# Altium project Communication_AVR.PrjPcb
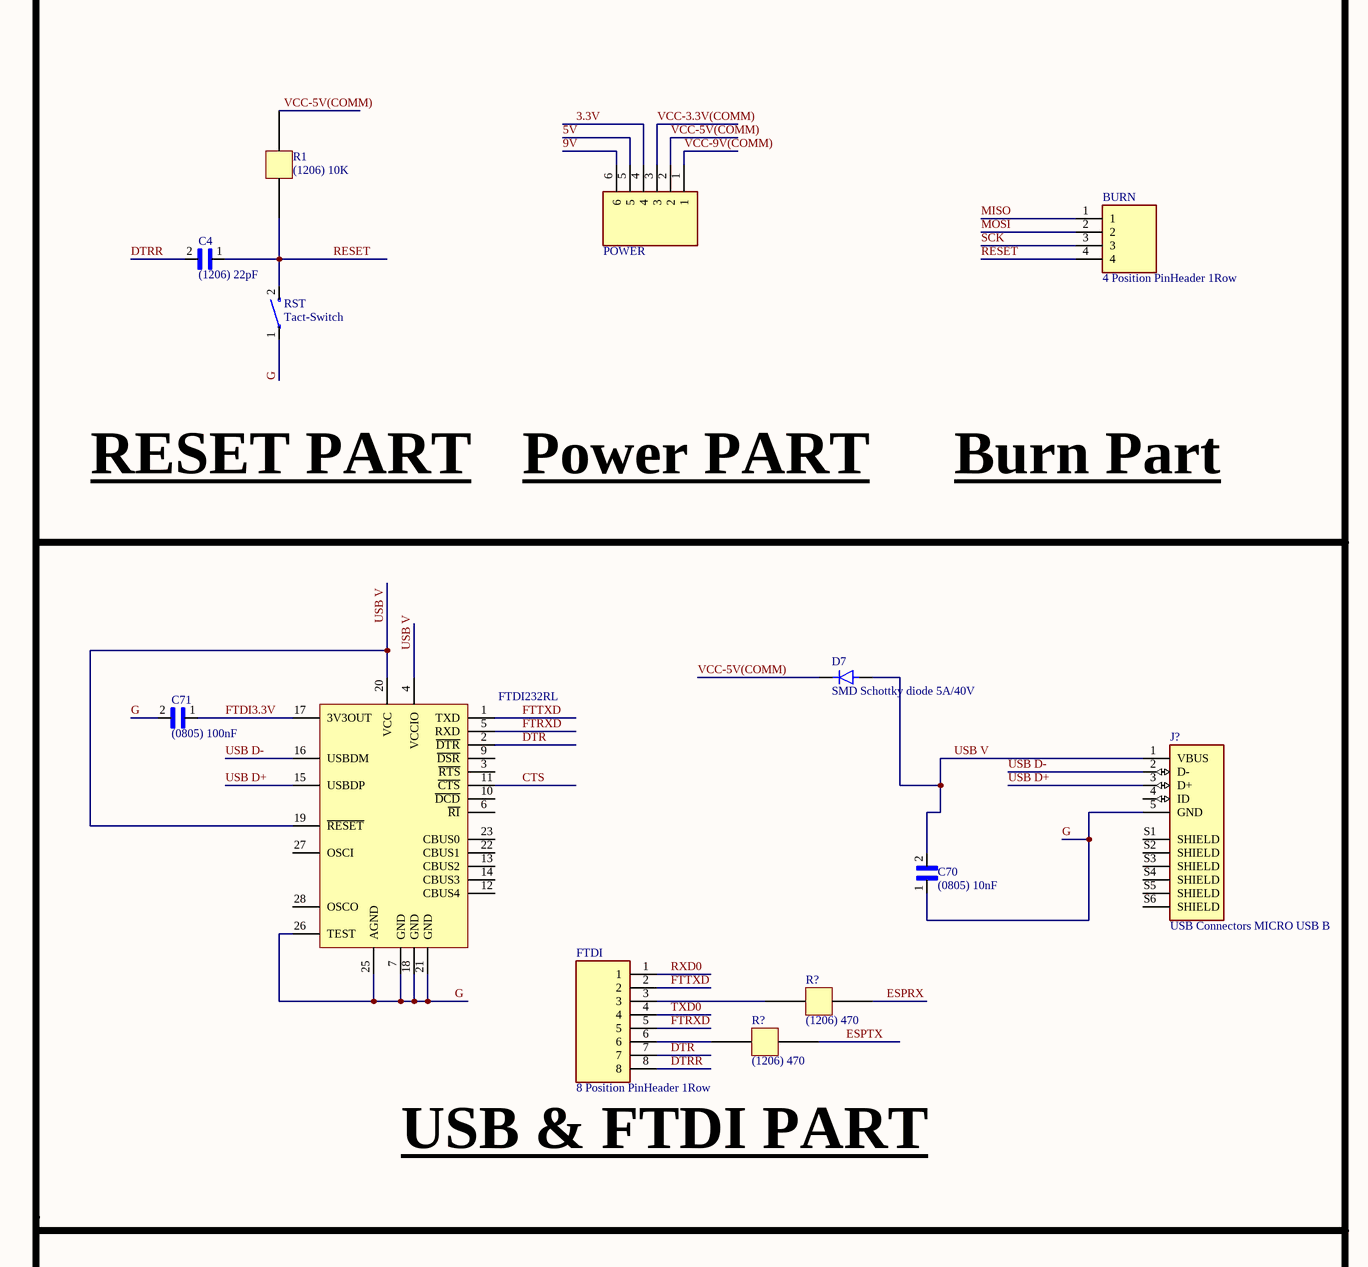
[diagram p0: Communication_Subsystem_ATmega2560AU.SchDoc, top left]
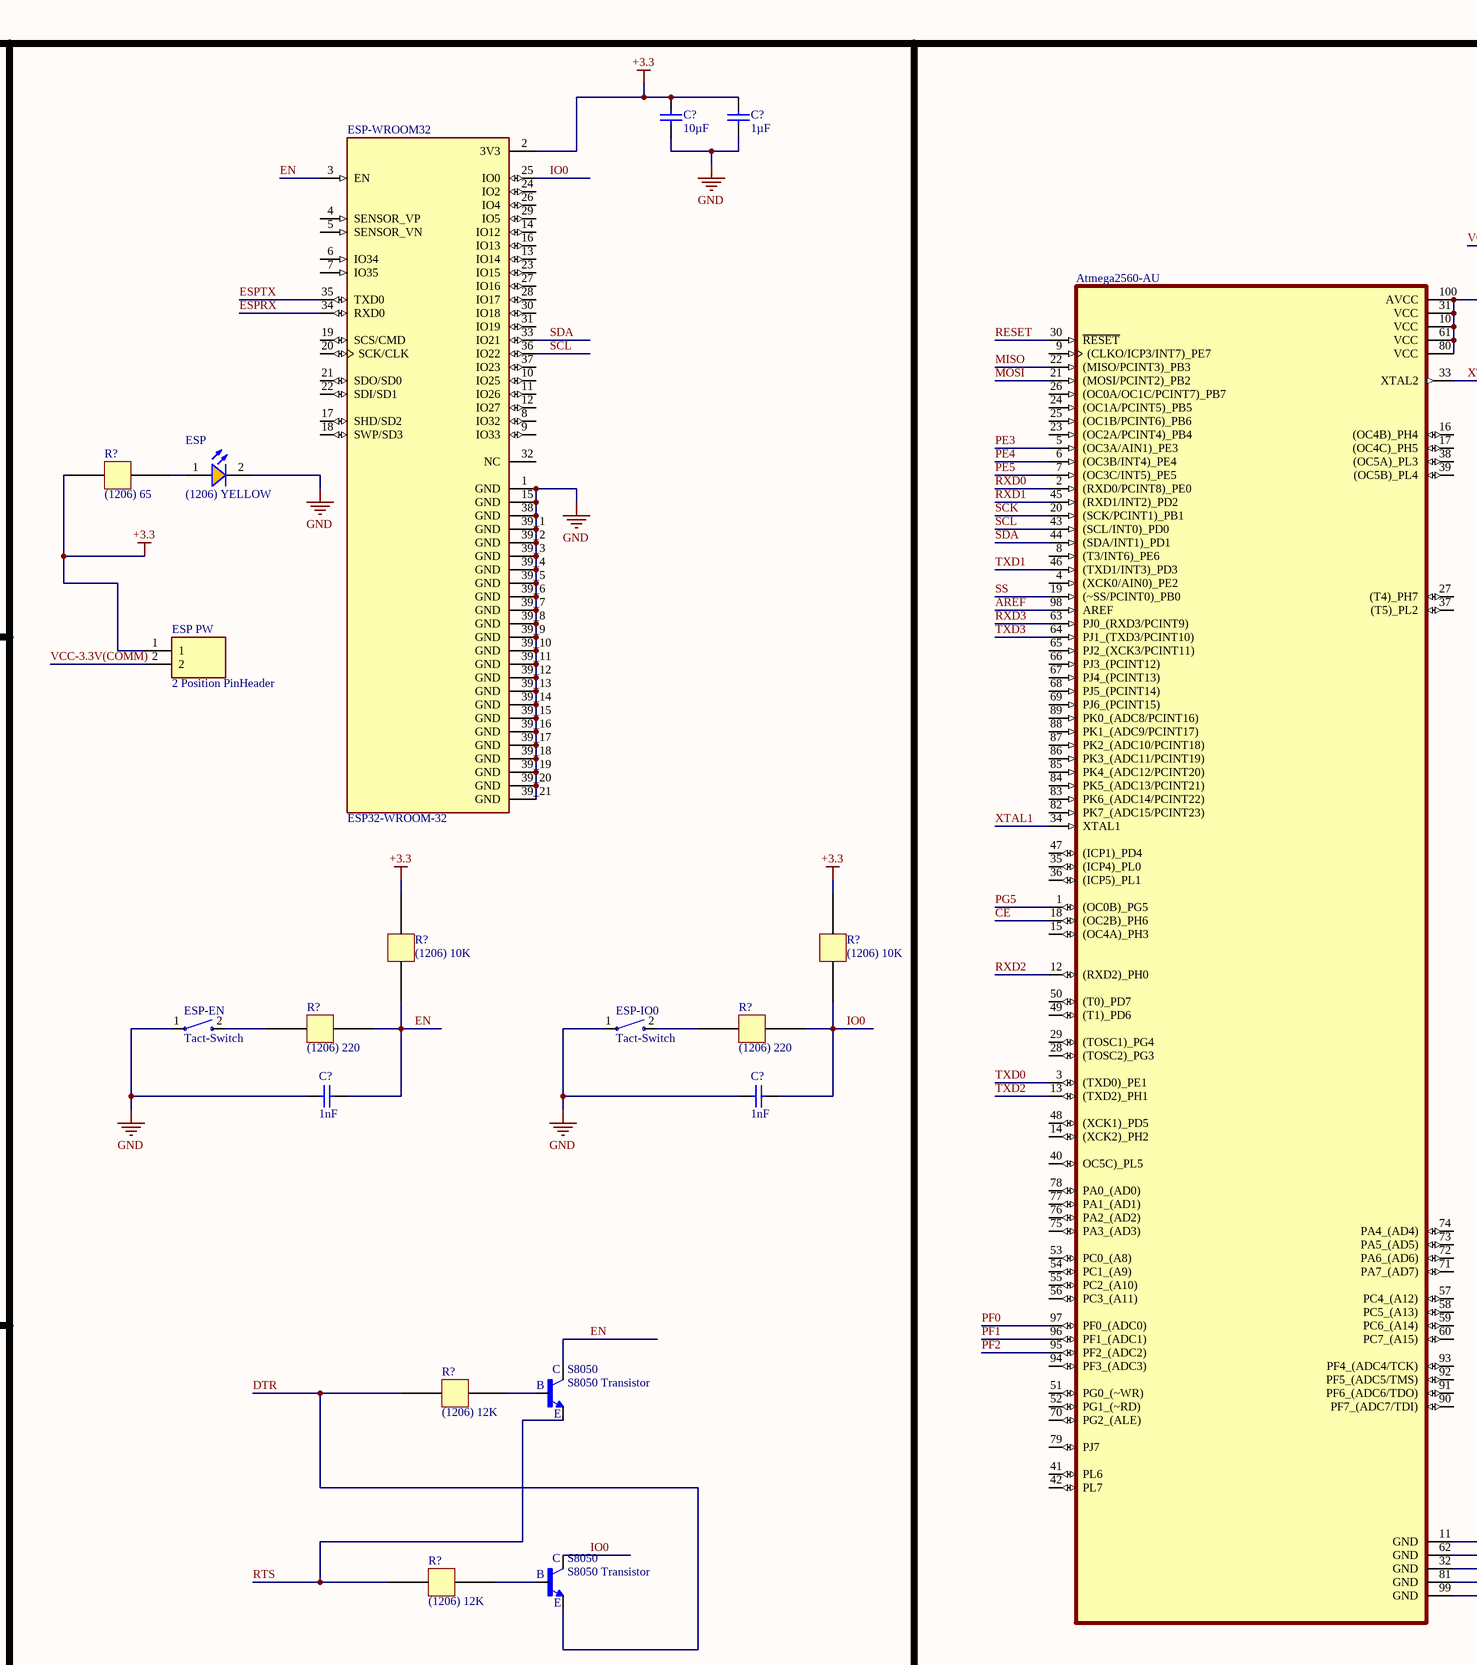
[diagram p1: Communication_Subsystem_ATmega2560AU.SchDoc, top middle]
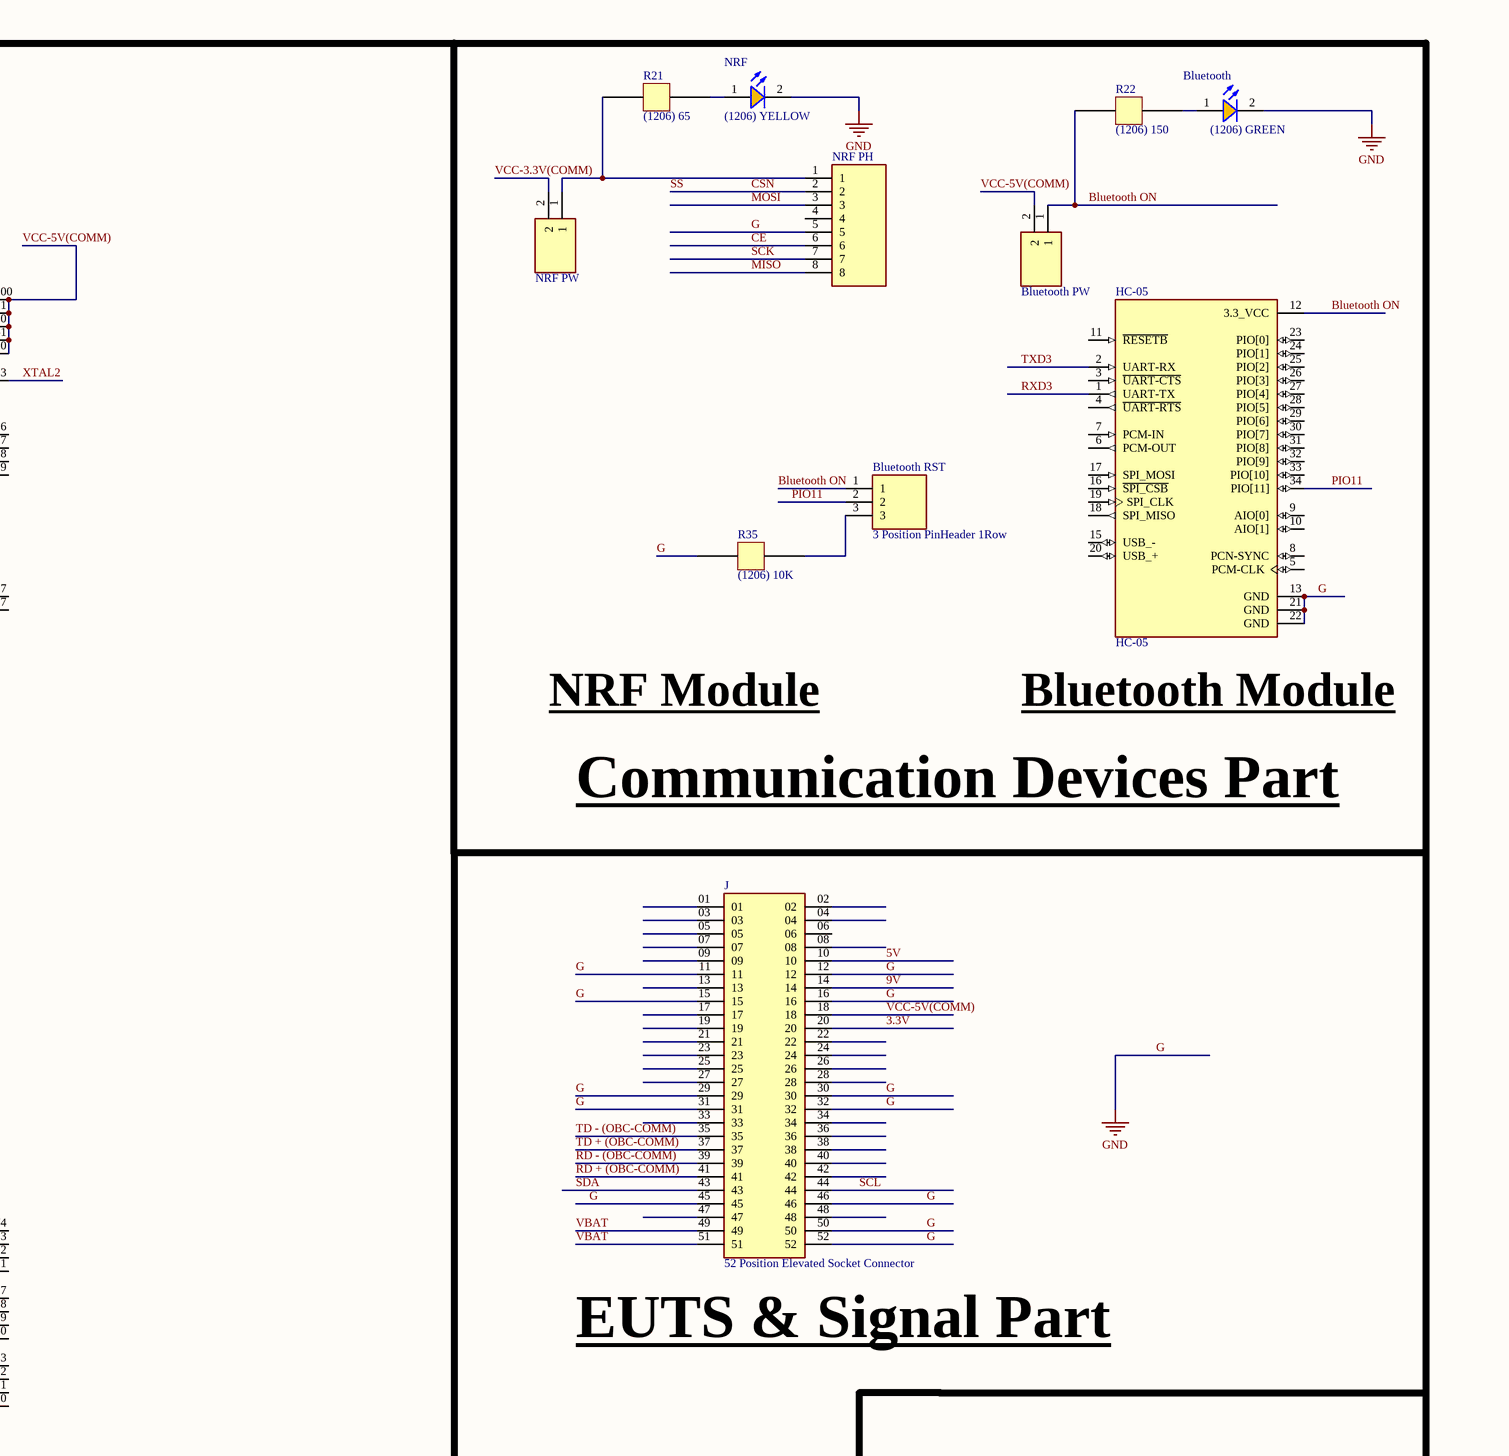
[diagram p2: Communication_Subsystem_ATmega2560AU.SchDoc, top right]
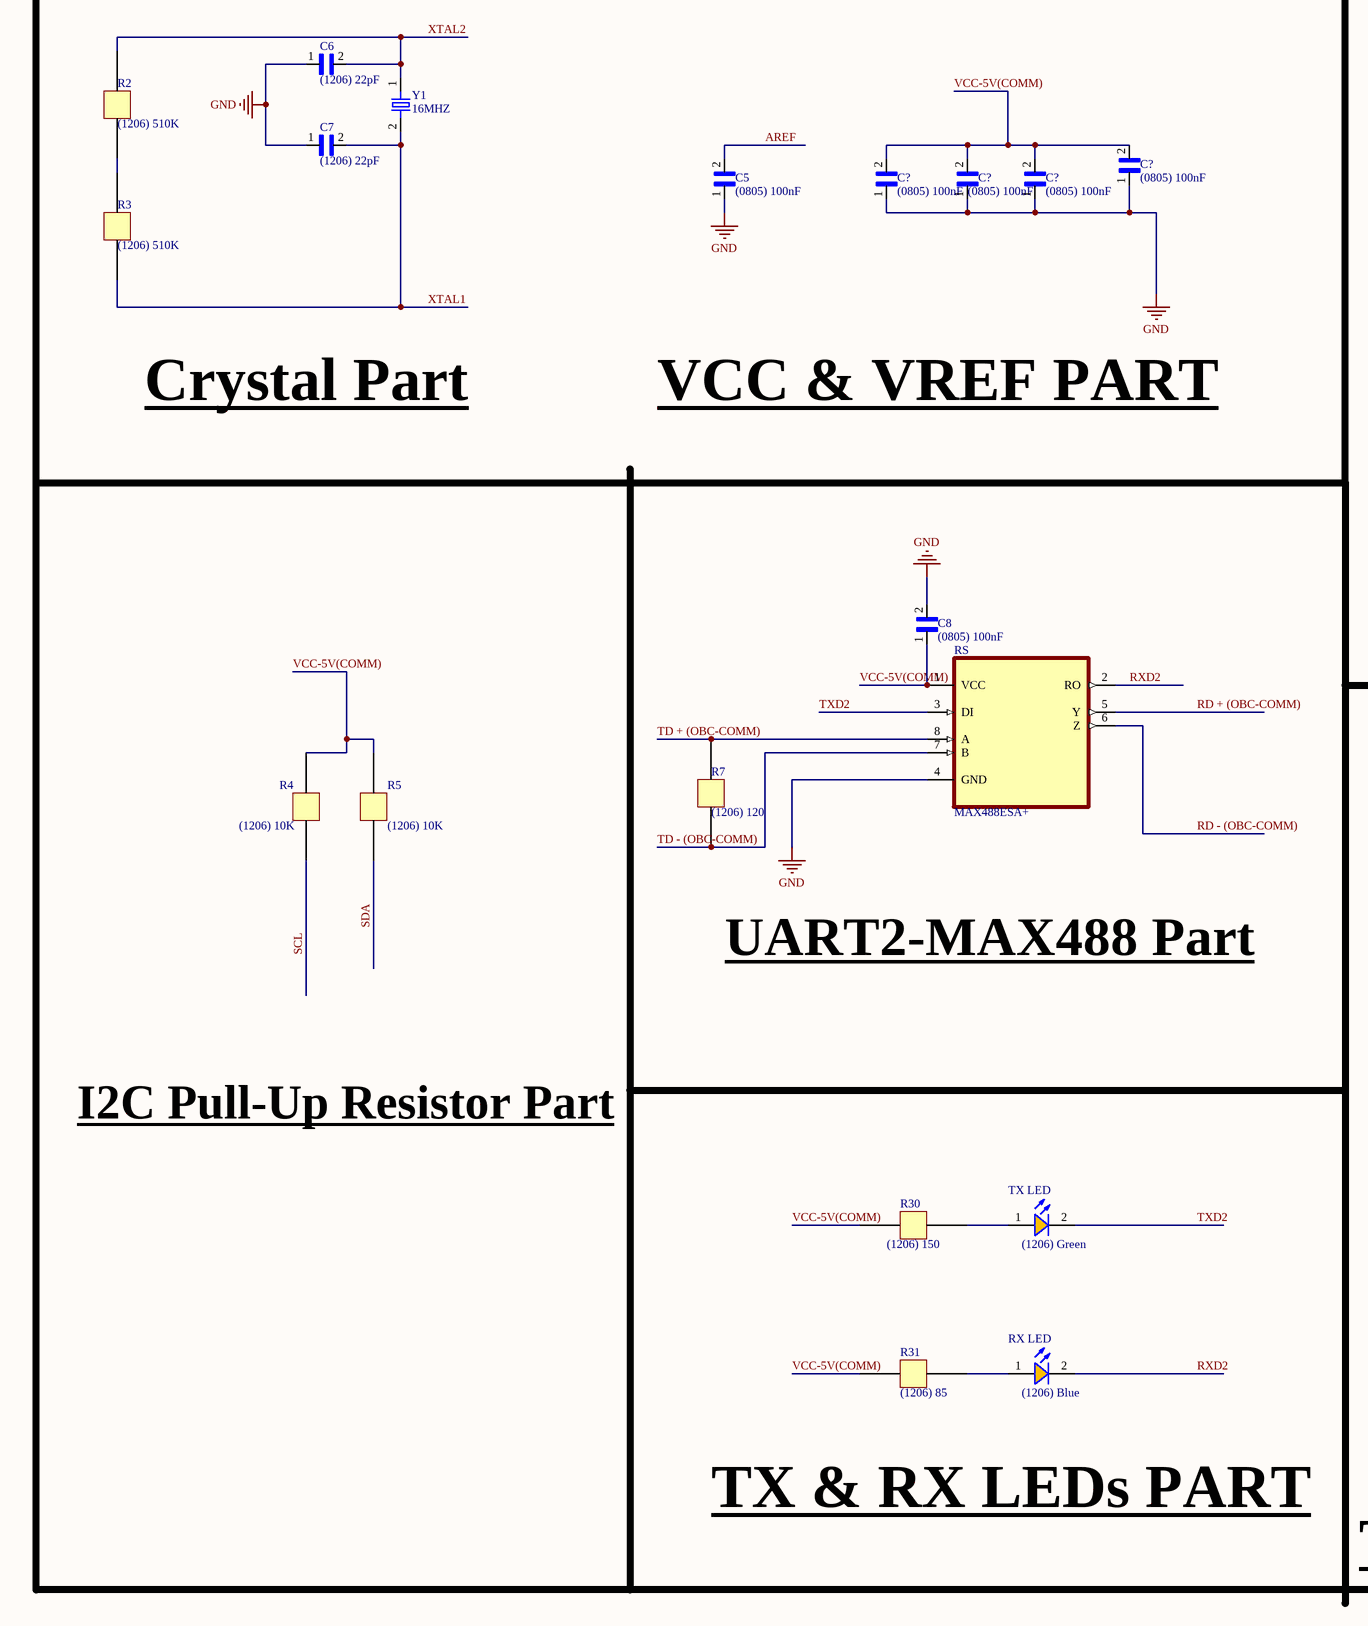
[diagram p3: Communication_Subsystem_ATmega2560AU.SchDoc, bottom left]
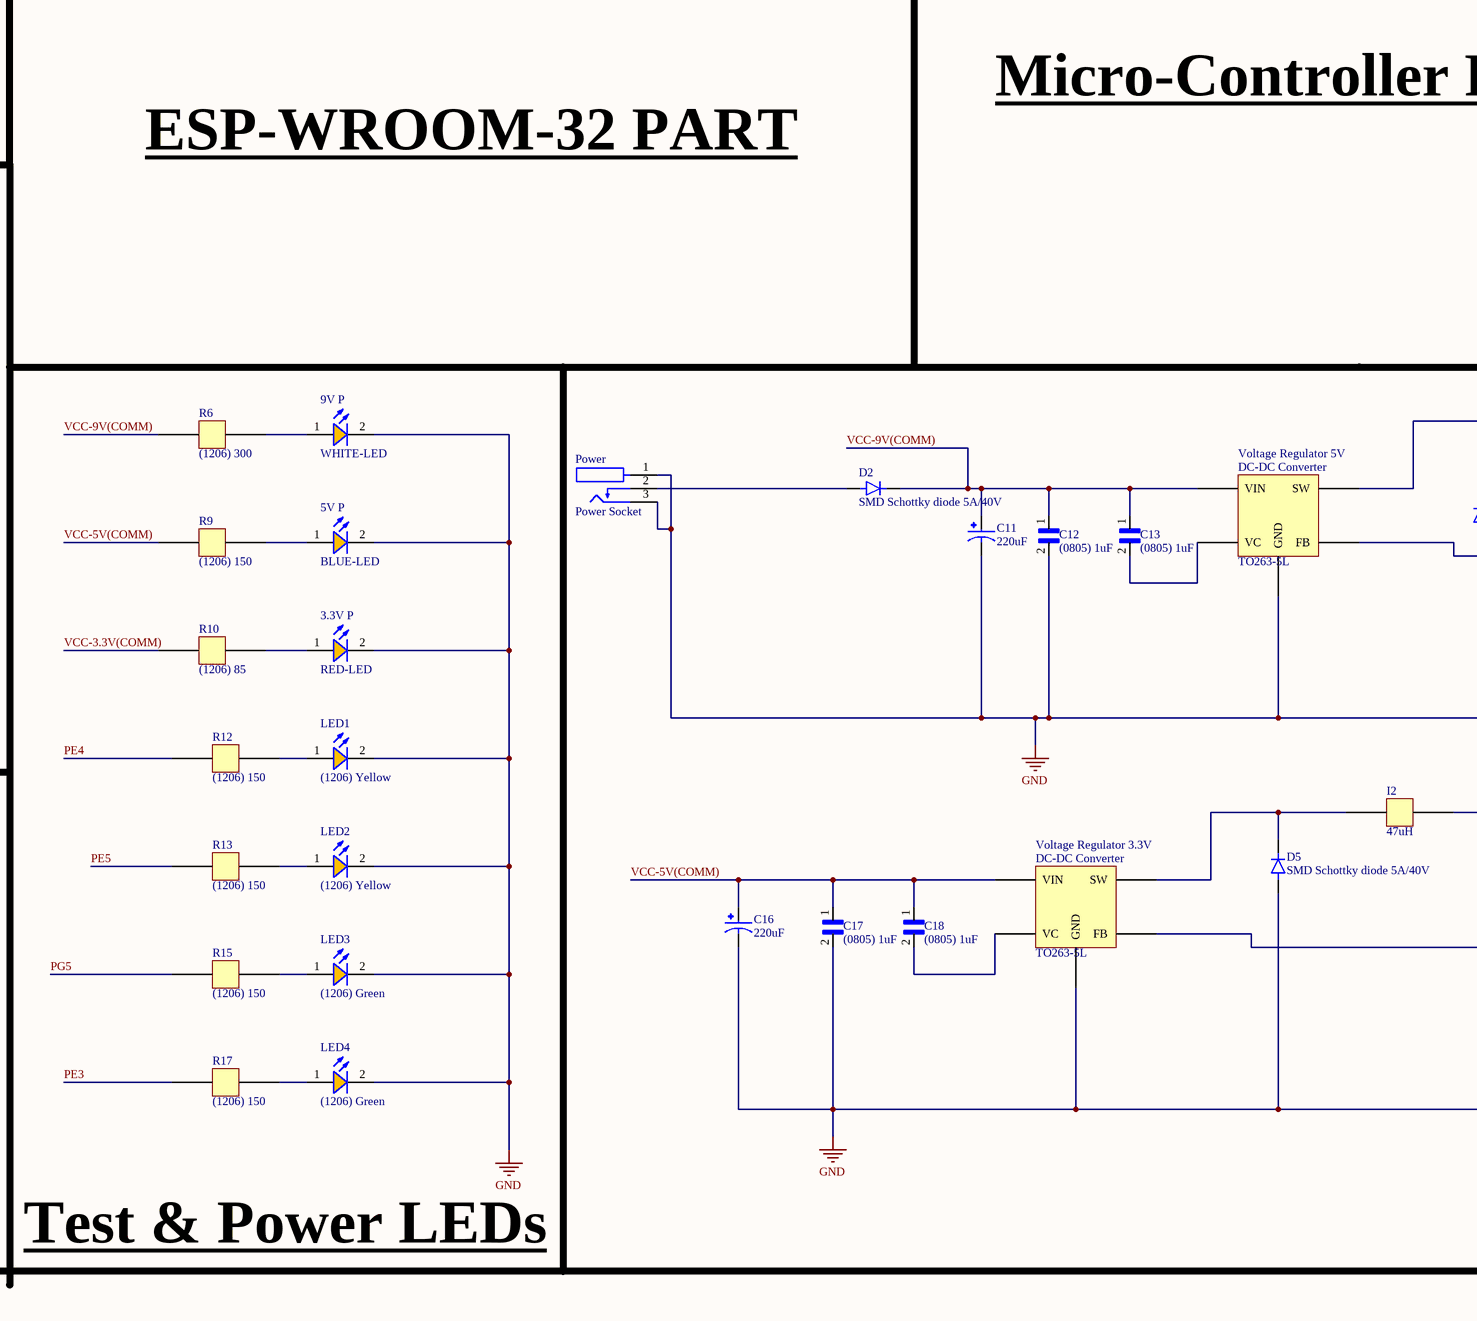
[diagram p4: Communication_Subsystem_ATmega2560AU.SchDoc, bottom middle]
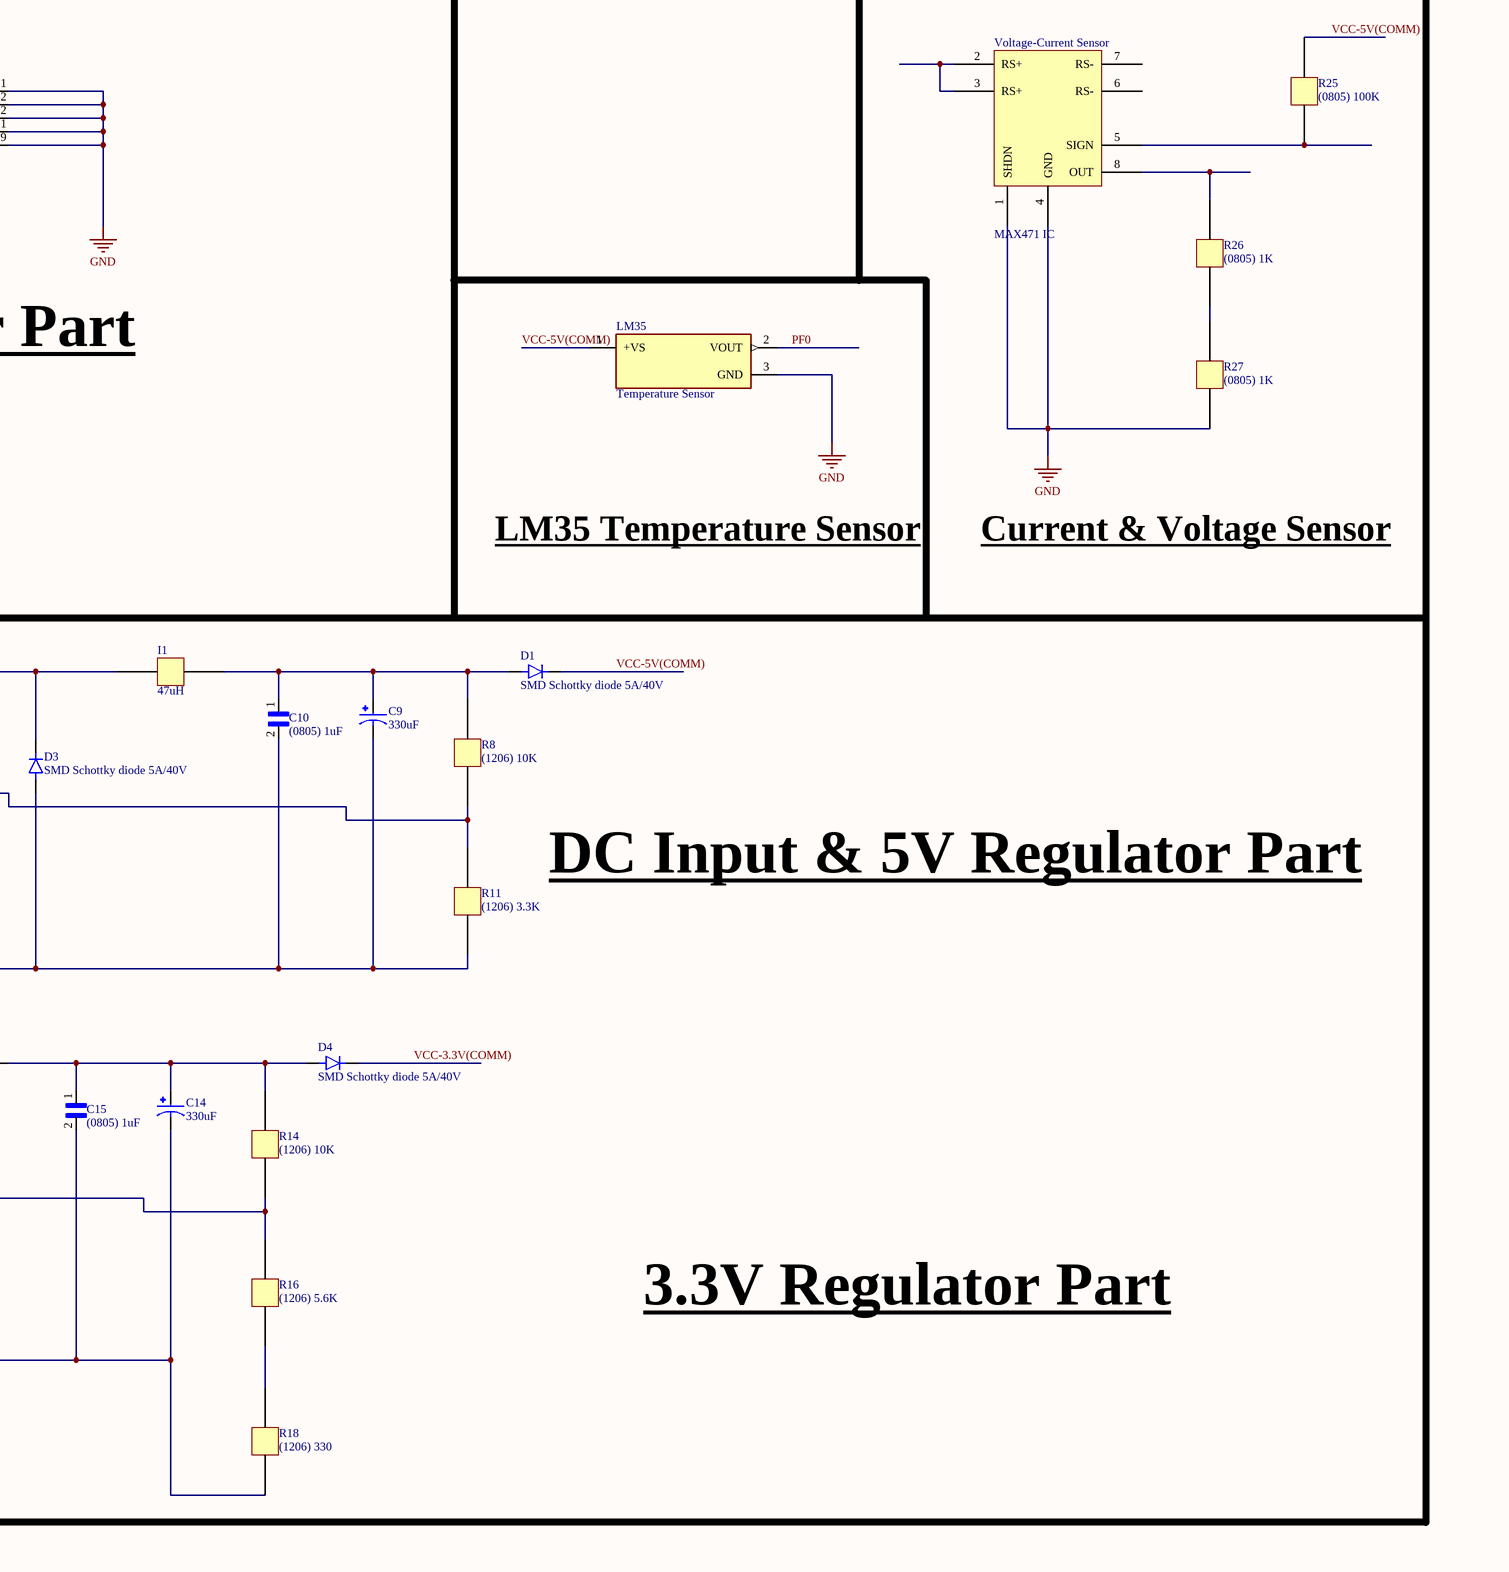
[diagram p5: Communication_Subsystem_ATmega2560AU.SchDoc, bottom right]
1 sheet, 106 parts. Net scope: global (net labels, ports and power ports of the same name join across sheets).
Board file: Communication_Subsystem_ATmega2560AU.PcbDoc

## Sheet Communication_Subsystem_ATmega2560AU.SchDoc
size A1; SheetNumber: 1; SheetTotal: 1

### Parts
(Parts that share a designator on the sheet are numbered #1, #2 ... from top to bottom, then left to right.)
3.3V_P  RED-LED  [RESC3015X65-01]
5V_P  BLUE-LED  [RESC3015X65-01]
9V_P  WHITE-LED  [RESC3015X65-01]
Atmega2560-AU  (no value)  [QFP50P1600X1600X120-100N]
Bluetooth  (1206) GREEN  [RESC3015X65-01]
Bluetooth_PW  2 Position PinHeader  [TE_2-103327-2]  (value not drawn)
Bluetooth_RST  3 Position PinHeader 1Row  [TE_3-103327-3]
BURN  4 Position PinHeader 1Row  [TE_3-644456-4]
C4  (1206) 22pF  [CAPC3216X125N0]
C5  (0805) 100nF  [CAPC2012X95N-0]
C6  (1206) 22pF  [CAPC3216X125N0]
C7  (1206) 22pF  [CAPC3216X125N0]
C8  (0805) 100nF  [CAPC2012X95N-0]
C9  330uF  [CAPPRD500W60D1250H2500]
C10  (0805) 1uF  [CAPC2012X95N-0]
C11  220uF  [CAPPRD500W60D1250H2500]
C12  (0805) 1uF  [CAPC2012X95N-0]
C13  (0805) 1uF  [CAPC2012X95N-0]
C14  330uF  [CAPPRD500W60D1250H2500]
C15  (0805) 1uF  [CAPC2012X95N-0]
C16  220uF  [CAPPRD500W60D1250H2500]
C17  (0805) 1uF  [CAPC2012X95N-0]
C18  (0805) 1uF  [CAPC2012X95N-0]
C70  (0805) 10nF  [CAPC2012X95N-0]
C71  (0805) 100nF  [CAPC2012X95N-0]
C?#1  Capacitance: 10µF  [0603 - cap]  (hidden comment: Cap_CER_1U_10V_0603)
C?#2  Capacitance: 1µF  [0603 - cap]  (hidden comment: Cap_CER_1U_10V_0603)
C?#3  Capacitance: 1nF  [0603 - cap]  (hidden comment: Cap_CER_1U_10V_0603)
C?#4  Capacitance: 1nF  [0603 - cap]  (hidden comment: Cap_CER_1U_10V_0603)
C?#5  (0805) 100nF  [CAPC2012X95N-0]
C?#6  (0805) 100nF  [CAPC2012X95N-0]
C?#7  (0805) 100nF  [CAPC2012X95N-0]
C?#8  (0805) 100nF  [CAPC2012X95N-0]
D1  SMD Schottky diode 5A/40V  [DIOM5227X270N]
D2  SMD Schottky diode 5A/40V  [DIOM5227X270N]
D3  SMD Schottky diode 5A/40V  [DIOM5227X270N]
D4  SMD Schottky diode 5A/40V  [DIOM5227X270N]
D5  SMD Schottky diode 5A/40V  [DIOM5227X270N]
D7  SMD Schottky diode 5A/40V  [DIOM5227X270N]
ESP  (1206) YELLOW  [RESC3015X65-01]
ESP-EN  Tact-Switch  [Tact Switch]
ESP-IO0  Tact-Switch  [Tact Switch]
ESP-WROOM32  ESP32-WROOM-32  [MODULE_ESP32-WROOM-32]
ESP_PW  2 Position PinHeader  [TE_2-103327-2]
FTDI  8 Position PinHeader 1Row  [TE_5-534237-6]
FTDI232RL  IC_FT232RL  [SSOP-28]  (value not drawn)
HC-05  HC-05  [XCVR_HC-05]
I1  47uH  [IND]
I2  47uH  [IND]
J  52 Position Elevated Socket Connector  [SAMTEC_ESQ-126-39-G-D]
J?  USB Connectors MICRO USB B  [MOLEX_47346-0001]
LED1  (1206) Yellow  [RESC3015X65-01]
LED2  (1206) Yellow  [RESC3015X65-01]
LED3  (1206) Green  [RESC3015X65-01]
LED4  (1206) Green  [RESC3015X65-01]
LM35  Temperature Sensor  [TO92127P521H735-4]
NRF  (1206) YELLOW  [RESC3015X65-01]
NRF_PH  8 Position PinHeader 2Row  [TE_8-146256-8]  (value not drawn)
NRF_PW  2 Position PinHeader  [TE_2-103327-2]  (value not drawn)
POWER#1  6 Position PinHeader 1Row  [TE_6-146285-6]  (value not drawn)
Power#2  Power Socket  [GRAVITECH_CON-SOCJ-2155]
R1  (1206) 10K  [CAPC3216X125N0]
R2  (1206) 510K  [CAPC3216X125N0]
R3  (1206) 510K  [CAPC3216X125N0]
R4  (1206) 10K  [CAPC3216X125N0]
R5  (1206) 10K  [CAPC3216X125N0]
R6  (1206) 300  [CAPC3216X125N0]
R7  (1206) 120  [CAPC3216X125N0]
R8  (1206) 10K  [CAPC3216X125N0]
R9  (1206) 150  [CAPC3216X125N0]
R10  (1206) 85  [CAPC3216X125N0]
R11  (1206) 3.3K  [CAPC3216X125N0]
R12  (1206) 150  [CAPC3216X125N0]
R13  (1206) 150  [CAPC3216X125N0]
R14  (1206) 10K  [CAPC3216X125N0]
R15  (1206) 150  [CAPC3216X125N0]
R16  (1206) 5.6K  [CAPC3216X125N0]
R17  (1206) 150  [CAPC3216X125N0]
R18  (1206) 330  [CAPC3216X125N0]
R21  (1206) 65  [CAPC3216X125N0]
R22  (1206) 150  [CAPC3216X125N0]
R25  (0805) 100K  [CAPC2012X95N-0]
R26  (0805) 1K  [CAPC2012X95N-0]
R27  (0805) 1K  [CAPC2012X95N-0]
R30  (1206) 150  [CAPC3216X125N0]
R31  (1206) 85  [CAPC3216X125N0]
R35  (1206) 10K  [CAPC3216X125N0]
R?#1  (1206) 65  [CAPC3216X125N0]
R?#2  (1206) 10K  [CAPC3216X125N0]
R?#3  (1206) 10K  [CAPC3216X125N0]
R?#4  (1206) 220  [CAPC3216X125N0]
R?#5  (1206) 220  [CAPC3216X125N0]
R?#6  (1206) 470  [CAPC3216X125N0]
R?#7  (1206) 470  [CAPC3216X125N0]
R?#8  (1206) 12K  [CAPC3216X125N0]
R?#9  (1206) 12K  [CAPC3216X125N0]
RS  MAX488ESA+  [SOIC127P600X175-8N0]
RST  Tact-Switch  [Tact Switch]
RX_LED  (1206) Blue  [RESC3015X65-01]
S8050#1  S8050 Transistor  [S8050-Transistor]
S8050#2  S8050 Transistor  [S8050-Transistor]
TX_LED  (1206) Green  [RESC3015X65-01]
Voltage-Current_Sensor  MAX471 IC  [SOIC127P600X168-8N]
Voltage_Regulator_3.3V  Voltage Regulator  [TO-263-5]  (value not drawn)
Voltage_Regulator_5V  Voltage Regulator  [TO-263-5]  (value not drawn)
Y1  16MHZ  [XTAL1140X490X430N-0]

### Nets
+3.3: C?#1.2 C?#2.2 ESP-WROOM32.2(3V3) ESP_PW.1 R?#1.1 R?#2.2 R?#3.2
G: 3.3V_P.2(K) 5V_P.2(K) 9V_P.2(K) Atmega2560-AU.11(GND) Atmega2560-AU.32(GND) Atmega2560-AU.62(GND) Atmega2560-AU.81(GND) Atmega2560-AU.99(GND) Bluetooth.2(K) C5.1 C6.1 C7.1 C8.2 C9.N C10.2 C11.N C12.2 C14.N C15.2 C16.N C17.2 C70.1 C71.2 C?#1.1 C?#2.1 C?#3.1 C?#4.1 C?#5.1 C?#6.1 C?#7.1 C?#8.1 D3.A D5.A ESP.2(K) ESP-EN.1 ESP-IO0.1 ESP-WROOM32.1(GND) ESP-WROOM32.15(GND) ESP-WROOM32.38(GND) ESP-WROOM32.39_1(GND) ESP-WROOM32.39_2(GND) ESP-WROOM32.39_3(GND) ESP-WROOM32.39_4(GND) ESP-WROOM32.39_5(GND) ESP-WROOM32.39_6(GND) ESP-WROOM32.39_7(GND) ESP-WROOM32.39_8(GND) ESP-WROOM32.39_9(GND) ESP-WROOM32.39_10(GND) ESP-WROOM32.39_11(GND) ESP-WROOM32.39_12(GND) ESP-WROOM32.39_13(GND) ESP-WROOM32.39_14(GND) ESP-WROOM32.39_15(GND) ESP-WROOM32.39_16(GND) ESP-WROOM32.39_17(GND) ESP-WROOM32.39_18(GND) ESP-WROOM32.39_19(GND) ESP-WROOM32.39_20(GND) ESP-WROOM32.39_21(GND) FTDI232RL.7(GND) FTDI232RL.18(GND) FTDI232RL.21(GND) FTDI232RL.25(AGND) FTDI232RL.26(TEST) HC-05.13(GND) HC-05.21(GND) HC-05.22(GND) J.11 J.12 J.15 J.16 J.29 J.30 J.31 J.32 J.45 J.46 J.50 J.52 J?.5(GND) LED1.2(K) LED2.2(K) LED3.2(K) LED4.2(K) LM35.3(GND) NRF.2(K) NRF_PH.5 Power#2.1 Power#2.3 R11.1 R18.1 R27.1 R35.1 RS.4(GND) RST.1 Voltage-Current_Sensor.1(SHDN) Voltage-Current_Sensor.4(GND) Voltage_Regulator_3.3V.1(GND) Voltage_Regulator_5V.1(GND)  [also labelled GND]
NC: FTDI232RL.8(NC) FTDI232RL.24(NC)
3.3V: J.20 POWER#1.4
5V: J.10 POWER#1.5
9V: J.14 POWER#1.6
AREF: Atmega2560-AU.98(AREF) C5.2
Bluetooth ON: Bluetooth_PW.1 Bluetooth_RST.1 HC-05.12(3.3_VCC) R22.1
CE: Atmega2560-AU.18((OC2B)_PH6) NRF_PH.6
CSN: Atmega2560-AU.19((~SS/PCINT0)_PB0) NRF_PH.2  [also labelled SS]
CTS: FTDI232RL.11(~{CTS})
DTR: FTDI.7 FTDI232RL.2(~{DTR}) R?#8.1 S8050#2.1(E)
DTRR: C4.2 FTDI.8
EN: C?#3.2 ESP-WROOM32.3(EN) R?#2.1 R?#4.2 S8050#1.3(C)
ESPRX: ESP-WROOM32.34(RXD0) R?#6.2
ESPTX: ESP-WROOM32.35(TXD0) R?#7.2
FTDI3.3V: C71.1 FTDI232RL.17(3V3OUT)
FTRXD: FTDI.5 FTDI232RL.5(RXD)
FTTXD: FTDI.2 FTDI232RL.1(TXD)
IO0: C?#4.2 ESP-WROOM32.25(IO0) R?#3.1 R?#5.2 S8050#2.3(C)
MISO: Atmega2560-AU.22((MISO/PCINT3)_PB3) BURN.1 NRF_PH.8
MOSI: Atmega2560-AU.21((MOSI/PCINT2)_PB2) BURN.2 NRF_PH.3
PE3: Atmega2560-AU.5((OC3A/AIN1)_PE3) R17.1
PE4: Atmega2560-AU.6((OC3B/INT4)_PE4) R12.1
PE5: Atmega2560-AU.7((OC3C/INT5)_PE5) R13.1
PF0: Atmega2560-AU.97(PF0_(ADC0)) LM35.2(VOUT)
PF1: Atmega2560-AU.96(PF1_(ADC1))
PF2: Atmega2560-AU.95(PF2_(ADC2))
PG5: Atmega2560-AU.1((OC0B)_PG5) R15.1
PIO11: Bluetooth_RST.2 HC-05.34(PIO[11])
RD + (OBC-COMM): J.41 RS.5(Y)
RD - (OBC-COMM): J.39 RS.6(Z)
RESET: Atmega2560-AU.30(~{RESET}) BURN.4 C4.1 R1.2 RST.2
RTS: R?#9.1 S8050#1.1(E)
RXD0: Atmega2560-AU.2((RXD0/PCINT8)_PE0) FTDI.1
RXD1: Atmega2560-AU.45((RXD1/INT2)_PD2)
RXD2: Atmega2560-AU.12((RXD2)_PH0) RS.2(RO) RX_LED.2(K)
RXD3: Atmega2560-AU.63(PJ0_(RXD3/PCINT9)) HC-05.1(UART-TX)
SCK: Atmega2560-AU.20((SCK/PCINT1)_PB1) BURN.3 NRF_PH.7
SCL: Atmega2560-AU.43((SCL/INT0)_PD0) ESP-WROOM32.36(IO22) J.44 R4.2
SDA: Atmega2560-AU.44((SDA/INT1)_PD1) ESP-WROOM32.33(IO21) J.43 R5.2
TD + (OBC-COMM): J.37 R7.2 RS.8(A)
TD - (OBC-COMM): J.35 R7.1 RS.7(B)
TXD0: Atmega2560-AU.3((TXD0)_PE1) FTDI.4
TXD1: Atmega2560-AU.46((TXD1/INT3)_PD3)
TXD2: Atmega2560-AU.13((TXD2)_PH1) RS.3(DI) TX_LED.2(K)
TXD3: Atmega2560-AU.64(PJ1_(TXD3/PCINT10)) HC-05.2(UART-RX)
USB D+: FTDI232RL.15(USBDP) J?.3(D+)
USB D-: FTDI232RL.16(USBDM) J?.2(D-)
USB V: C70.2 D7.A FTDI232RL.4(VCCIO) FTDI232RL.19(~{RESET}) FTDI232RL.20(VCC) J?.1(VBUS)
VBAT: J.49 J.51
VCC-3.3V(COMM): D4.C(K) ESP_PW.2 NRF_PW.2 POWER#1.3 R10.1
VCC-5V(COMM): Atmega2560-AU.10(VCC) Atmega2560-AU.31(VCC) Atmega2560-AU.61(VCC) Atmega2560-AU.80(VCC) Atmega2560-AU.100(AVCC) Bluetooth_PW.2 C8.1 C16.P C17.1 C18.1 C?#5.2 C?#6.2 C?#7.2 C?#8.2 D1.C(K) D7.C(K) J.18 LM35.1(+VS) POWER#1.2 R1.1 R4.1 R5.1 R9.1 R25.2 R30.1 R31.1 RS.1(VCC) Voltage_Regulator_3.3V.5(VIN)
VCC-9V(COMM): C11.P C12.1 C13.1 D2.C(K) POWER#1.1 R6.1 Voltage_Regulator_5V.5(VIN)
XTAL1: Atmega2560-AU.34(XTAL1) C7.2 R3.1 Y1.2
XTAL2: Atmega2560-AU.33(XTAL2) C6.2 R2.2 Y1.1
Net3.3V_P_1: 3.3V_P.1(A) R10.2
Net5V_P_1: 5V_P.1(A) R9.2
Net9V_P_1: 9V_P.1(A) R6.2
NetBluetooth_1: Bluetooth.1(A) R22.2
NetBluetooth_RST_3: Bluetooth_RST.3 R35.2
NetC9_P: C9.P C10.1 D1.A I1.2 R8.2
NetC13_2: C13.2 Voltage_Regulator_5V.4(VC)
NetC14_P: C14.P C15.1 D4.A I2.2 R14.2
NetC18_2: C18.2 Voltage_Regulator_3.3V.4(VC)
NetD2_A: D2.A Power#2.2
NetD3_C: D3.C(K) I1.1 Voltage_Regulator_5V.3(SW)
NetD5_C: D5.C(K) I2.1 Voltage_Regulator_3.3V.3(SW)
NetESP-EN_2: ESP-EN.2 R?#4.1
NetESP-IO0_2: ESP-IO0.2 R?#5.1
NetESP_1: ESP.1(A) R?#1.2
NetFTDI_3: FTDI.3 R?#6.1
NetFTDI_6: FTDI.6 R?#7.1
NetLED1_1: LED1.1(A) R12.2
NetLED2_1: LED2.1(A) R13.2
NetLED3_1: LED3.1(A) R15.2
NetLED4_1: LED4.1(A) R17.2
NetNRF_1: NRF.1(A) R21.2
NetNRF_PH_1: NRF_PH.1 NRF_PW.1 R21.1
NetR2_1: R2.1 R3.2
NetR8_1: R8.1 R11.2 Voltage_Regulator_5V.2(FB)
NetR14_1: R14.1 R16.2 Voltage_Regulator_3.3V.2(FB)
NetR16_1: R16.1 R18.2
NetR25_1: R25.1 Voltage-Current_Sensor.5(SIGN)
NetR26_1: R26.1 R27.2
NetR26_2: R26.2 Voltage-Current_Sensor.8(OUT)
NetR30_2: R30.2 TX_LED.1(A)
NetR31_2: R31.2 RX_LED.1(A)
NetR?#8_2: R?#8.2 S8050#1.2(B)
NetR?#9_2: R?#9.2 S8050#2.2(B)
NetVoltage-Current_Sensor_2: Voltage-Current_Sensor.2(RS+) Voltage-Current_Sensor.3(RS+)

Not connected (* = marked no-connect by the designer): Atmega2560-AU 4((XCK0/AIN0)_PE2) 8((T3/INT6)_PE6) 9((CLKO/ICP3/INT7)_PE7) 14((XCK2)_PH2) 15((OC4A)_PH3) 16((OC4B)_PH4) 17((OC4C)_PH5) 23((OC2A/PCINT4)_PB4) 24((OC1A/PCINT5)_PB5) 25((OC1B/PCINT6)_PB6) 26((OC0A/OC1C/PCINT7)_PB7) 27((T4)_PH7) 28((TOSC2)_PG3) 29((TOSC1)_PG4) 35((ICP4)_PL0) 36((ICP5)_PL1) 37((T5)_PL2) 38((OC5A)_PL3) 39((OC5B)_PL4) 40(OC5C)_PL5) 41(PL6) 42(PL7) 47((ICP1)_PD4) 48((XCK1)_PD5) 49((T1)_PD6) 50((T0)_PD7) 51(PG0_(~WR)) 52(PG1_(~RD)) 53(PC0_(A8)) 54(PC1_(A9)) 55(PC2_(A10)) 56(PC3_(A11)) 57(PC4_(A12)) 58(PC5_(A13)) 59(PC6_(A14)) 60(PC7_(A15)) 65(PJ2_(XCK3/PCINT11)) 66(PJ3_(PCINT12)) 67(PJ4_(PCINT13)) 68(PJ5_(PCINT14)) 69(PJ6_(PCINT15)) 70(PG2_(ALE)) 71(PA7_(AD7)) 72(PA6_(AD6)) 73(PA5_(AD5)) 74(PA4_(AD4)) 75(PA3_(AD3)) 76(PA2_(AD2)) 77(PA1_(AD1)) 78(PA0_(AD0)) 79(PJ7) 82(PK7_(ADC15/PCINT23)) 83(PK6_(ADC14/PCINT22)) 84(PK5_(ADC13/PCINT21)) 85(PK4_(ADC12/PCINT20)) 86(PK3_(ADC11/PCINT19)) 87(PK2_(ADC10/PCINT18)) 88(PK1_(ADC9/PCINT17)) 89(PK0_(ADC8/PCINT16)) 90(PF7_(ADC7/TDI)) 91(PF6_(ADC6/TDO)) 92(PF5_(ADC5/TMS)) 93(PF4_(ADC4/TCK)) 94(PF3_(ADC3)); ESP-WROOM32 4(SENSOR_VP) 5(SENSOR_VN) 6(IO34) 7(IO35) 8(IO32) 9(IO33) 10(IO25) 11(IO26) 12(IO27) 13(IO14) 14(IO12) 16(IO13) 17(SHD/SD2) 18(SWP/SD3) 19(SCS/CMD) 20(SCK/CLK) 21(SDO/SD0) 22(SDI/SD1) 23(IO15) 24(IO2) 26(IO4) 27(IO16) 28(IO17) 29(IO5) 30(IO18) 31(IO19) 32(NC) 37(IO23); FTDI232RL 3(~{RTS}) 6(~{RI}) 9(~{DSR}) 10(~{DCD}) 12(CBUS4) 13(CBUS2) 14(CBUS3) 22(CBUS1) 23(CBUS0) 27(OSCI) 28(OSCO); HC-05 3(~{UART-CTS}) 4(~{UART-RTS}) 5(PCM-CLK) 6(PCM-OUT) 7(PCM-IN) 8(PCN-SYNC) 9(AIO[0]) 10(AIO[1]) 11(~{RESETB}) 15(USB_-) 16(~{SPI_CSB}) 17(SPI_MOSI) 18(SPI_MISO) 19(SPI_CLK) 20(USB_+) 23(PIO[0]) 24(PIO[1]) 25(PIO[2]) 26(PIO[3]) 27(PIO[4]) 28(PIO[5]) 29(PIO[6]) 30(PIO[7]) 31(PIO[8]) 32(PIO[9]) 33(PIO[10]); J 01 02 03 04 05 06 07 08 09 13 17 19 21 22 23 24 25 26 27 28 33 34 36 38 40 42 47 48; J? 4(ID) S1(SHIELD) S2(SHIELD) S3(SHIELD) S4(SHIELD) S5(SHIELD) S6(SHIELD); NRF_PH 4; Voltage-Current_Sensor 6(RS-) 7(RS-)

### Notes on the sheet
- RESET PART
- Power PART
- Burn Part
- NRF Module
- (near HC-05) Bluetooth Module
- Communication Devices Part
- (near FTDI) USB & FTDI PART
- (near J) EUTS & Signal Part
- Crystal Part
- VCC & VREF PART
- Micro-Controller Part
- ESP-WROOM-32 PART
- LM35 Temperature Sensor
- Current & Voltage Sensor
- UART2-MAX488 Part
- DC Input & 5V Regulator Part
- I2C Pull-Up Resistor Part
- 3.3V Regulator Part
- TX & RX LEDs PART
- Test & Power LEDs
- (in symbol Voltage Regulator) DC-DC Converter; TO263-5L

### Library data of the parts
3.3V_P 5V_P 9V_P Bluetooth ESP LED1-LED4 NRF RX_LED TX_LED = LED 1206: LED SMD 1206 High Quality Forward Voltage: 3.2 V / Brightness: 700 mcd; Manufacturer: Wurth Elektronik; Manufacturer Part Number: 150060AS75003; Chip Technology: AlInGaP; Dominant Wavelength: 605nm; Emitting Color: Amber; Forward Voltage: 2V; Luminous Intensity: 350mcd; Peak Wavelength: 610nm; Viewing Angle: 140°; ComponentLink1Description: Manufacturer Link; ComponentLink1URL: http://www.we-online.de; ComponentLink2Description: Datasheet; ComponentLink2URL: https://www.we-online.com/catalog/datasheet/150060AS75003.pdf; Height: 0.7mm; Length: 1.6mm; Mounting Technology: SMT; Operating Temperature max.: 100C; Operating Temperature min.: -40C; Packaging: Tape and Reel; Size: 0603; Width: 0.8mm
Atmega2560-AU = ATMEGA2560-16AU: Value: *; MP: ATMEGA2560-16AU; Package: None; Availability: Unavailable; Price: None
Bluetooth_PW ESP_PW NRF_PW = 2 Position PinHeader: Cabezal del conector Agujero pasante 2 posiciones 0,100 (2,54 mm); MP: 4-103327-4; MF: TE Connectivity; SnapEDA_Link: https://www.snapeda.com/parts/4-103327-4/TE%20Connectivity%20AMP%20Connectors/view-part/2403998/?ref=snap; Purchase-URL: https://pricing.snapeda.com/search/part/4-103327-4/?ref=eda; Value: *; Package: None; EU_RoHS_Compliance: Compliant; Price: None; Availability: Warning; Check_prices: https://www.snapeda.com/parts/4-103327-4/TE%20Connectivity%20AMP%20Connectors/view-part/2403998/?ref=eda
Bluetooth_RST = 3 Position PinHeader 1Row: Conn Unshrouded Header HDR 3 POS 2.54mm Solder ST Thru-Hole Carton; MF: TE Connectivity; MP: 4-103327-5; Package: None; Value: *; TE_purchase_URL: https://www.te.com/usa-en/product-4-103327-5.html?te_bu=Cor&te_type=disp&te_campaign=seda_glo_cor-seda-global-disp-prtnr-fy19-seda-model-bom-cta_sma-317_1&elqCampaignId=32493; Price: None; SnapEDA_Link: https://www.snapeda.com/parts/4-103327-5/TE%20Connectivity%20AMP%20Connectors/view-part/2403997/?ref=snap; Availability: Unavailable; EU_RoHS_Compliance: Compliant
BURN = 4 Position PinHeader 1Row: Conn Unshrouded Header HDR 4 POS 2.54mm Solder ST Thru-Hole Bag/Box; MP: 3-644456-4; Number_of_Positions: 4; Product_Type: Connector; MF: TE Connectivity; Centerline_Pitch: 2.54 mm[.1 in]; Package: None; Availability: Warning; EU_RoHS_Compliance: Compliant; SnapEDA_Link: https://www.snapeda.com/parts/3-644456-4/TE%20Connectivity%20AMP%20Connectors/view-part/482664/?ref=snap; DigiKey-Purchase-URL: https://snapeda.com/shop?store=DigiKey&id=482664; Mouser-Purchase-URL: https://snapeda.com/shop?store=Mouser&id=482664; Price: None; Value: *
C4 C6 C7 = Capacitor 1206: UMF316B7103KFHT/1206 Capacitor; Package: None; Price: None; Value: *; MP: UMF316B7103KFHT; Availability: Unavailable
C5 C8 C10 C12 C13 C15 C17 C18 C70 C71 C?#5-C?#8 = Capacitor 0805: UMK212SD103KD-T/CAP CER 10000PF 50V 0805; Package: None; Price: None; Value: *; MP: UMK212SD103KD-T; Availability: Unavailable
C9 C11 C14 C16 = Aluminum Electrolytic Capacitor: Aluminum Electrolytic Capacitors - Radial Leaded 47uF 250volts AEC-Q200; MP: EEUEB2E470B; MF: Panasonic; Availability: In Stock; SnapEDA_Link: https://www.snapeda.com/parts/EEUEB2E470B/Panasonic/view-part/?ref=snap; Value: *; Price: None; Package: RADIAL-2 Panasonic; Check_prices: https://www.snapeda.com/parts/EEUEB2E470B/Panasonic/view-part/?ref=eda
C?#1-C?#4 = Capacitor 0603: Capacitor; Manufacturer: Taiyo Yuden; Manufacturer Part Number: LMK107B7105KA-T; Tolerance: ±10%; Voltage - Rated: 10V; Temperature Coefficient: X7R; Supplier 1: Digi-Key; RoHS: RoHS Compliant; Category: Capacitors; Stock 1: 600713; Pricing 1: 1=0.1, 10=0.042, 25=0.0308, 50=0.023, 100=0.0188, 250=0.01576, 500=0.01344, 1000=0.01056 (USD); Packaging: Cut Tape (CT); Part Status: Active; Operating Temperature: -55°C ~ 125°C; Features: -; Ratings: -; Applications: General Purpose; Mounting Type: Surface Mount, MLCC; Package / Case: 0603 (1608 Metric); Size / Dimension: 0.063" L x 0.031" W (1.60mm x 0.80mm); Height - Seated (Max): -; Thickness (Max): 0.035" (0.90mm); Lead Spacing: -; Lead Style: -; ComponentLink1URL: http://ds.yuden.co.jp/TYCOMPAS/ut/detail.do?productNo=LMK107B7105KA-T&fileName=LMK107B7105KA-T_SS&mode=specSheetDownload; ComponentLink1Description: http://ds.yuden.co.jp/TYCOMPAS/ut/detail.do?productNo=LMK107B7105KA-T&fileName=LMK107B7105KA-T_SS&mode=specSheetDownload; Supplier Part Number 1: 587-1242-1-ND
D1-D5 D7 = SMD Schottky diode 5A/40V: S1 Series 1000 V 1 A 1 uA Surface Mount General Purpose Rectifier - DO-214AC; MP: S1M; Price: None; Value: *; Availability: Unavailable; Package: None
ESP-EN ESP-IO0 RST = Tact-Switch: High Quality 3x6x2.7 mm SMD White Push Button Switch (Tact Switch); MP: 1437566-3; Price: None; Value: *; Package: None; Availability: Unavailable
FTDI = 8 Position PinHeader 1Row: Connector Socket Strip Receptacle 8 Position 2.54mm Solder Straight Through Hole; MF: TE Connectivity; MP: 5-534237-6; Centerline_Pitch: 2.54; Number_of_Positions: 8; Check_prices: https://www.snapeda.com/parts/5-534237-6/TE+Connectivity+AMP+Connectors/view-part/?ref=eda; Purchase-URL: https://pricing.snapeda.com/search/part/5-534237-6/?ref=eda; Price: None; SnapEDA_Link: https://www.snapeda.com/parts/5-534237-6/TE+Connectivity+AMP+Connectors/view-part/?ref=snap; Availability: In Stock; Package: None; Value: *; Product_Type: Connector; EU_RoHS_Compliance: Compliant
FTDI232RL = IC_FT232RL: FT232R USB UART; Manufacturer: *; Note: *; ManufacturerPartNo: *
HC-05 = HC-05: Bluetooth to Serial Port Module; Value: *; MP: HC-05; Package: None; Availability: Unavailable; Price: None
I1 I2 = Inductor DIP
J = 52 Position Elevated Socket Connector: ESQ-126-39-G-D/52 Position Elevated Socket Connector Through Hole; MF: Samtec; Package: None; MP: ESQ-126-39-G-D; Value: *; Availability: Unavailable; Price: None; SnapEDA_Link: https://www.snapeda.com/parts/ESQ-126-39-G-D/Samtec%20Inc./view-part/490181/?ref=snap
J? = USB Connectors MICRO USB B: USB Connectors MICRO USB B RECPT BTTM MOUNT ASSY; MP: 47346-0001; MF: Molex; Package: None; Purchase-URL: https://pricing.snapeda.com/search/part/47346-0001/?ref=eda; Check_prices: https://www.snapeda.com/parts/47346-0001/Molex/view-part/53503/?ref=eda; Value: *; Availability: Warning; Price: None; SnapEDA_Link: https://www.snapeda.com/parts/47346-0001/Molex/view-part/53503/?ref=snap
LM35 = LM35DZ/NOPB/Temperature Sensor: LM35DZ/NOPB/Temperature Sensor Analog, Local 0Â°C ~ 100Â°C 10mV/Â°C TO-92-3; MF: Texas Instruments; MP: LM35DZ; Value: *; SnapEDA_Link: https://www.snapeda.com/parts/LM35DZ/Texas+Instruments/view-part/?ref=snap; Price: None; Availability: Not in stock; Package: E-PKG AXIAL-LEADED-2 ON Semiconductor; Check_prices: https://www.snapeda.com/parts/LM35DZ/Texas+Instruments/view-part/?ref=eda
NRF_PH = 8 Position PinHeader 2Row: 08 MODII HDR DRST B/A .100CL LF; MP: 5-146256-4; MF: TE Connectivity; Package: None; Availability: Unavailable; Value: *; Price: None; SnapEDA_Link: https://www.snapeda.com/parts/5-146256-4/TE%20Connectivity%20AMP%20Connectors/view-part/500529/?ref=snap
POWER#1 = 6 Position PinHeader 1Row: Connector Header Through Hole 6 position 0.100 (2.54mm); MP: 5-146285-6; MF: TE Connectivity; DigiKey-Purchase-URL: https://snapeda.com/shop?store=DigiKey&id=2411669; EU_RoHS_Compliance: Compliant; Package: None; Value: *; SnapEDA_Link: https://www.snapeda.com/parts/5-146285-6/TE%20Connectivity%20AMP%20Connectors/view-part/2411669/?ref=snap; Digi-Key_Part_Number: A122872-ND; Check_prices: https://www.snapeda.com/parts/5-146285-6/TE%20Connectivity%20AMP%20Connectors/view-part/2411669/?ref=eda
Power#2 = Power Socket: CON-SOCJ-2155\DC Power Connectors Power Jack/Connector 2.1mm x 5.5mm; Price: None; Package: None; Availability: Unavailable; MP: CON-SOCJ-2155; Value: *
R1-R18 R21 R22 R30 R31 R35 R?#1-R?#9 = Resistor 1206
R25-R27 = Resistor 0805
RS = MAX488ESA+: 1/1 Transceiver Full RS422, RS485 8-SOIC; MP: MAX488ESA+T; MF: Maxim Integrated; Price: None; Package: SOIC-8 Maxim; Availability: Unavailable; SnapEDA_Link: https://www.snapeda.com/parts/MAX488ESA+T/Maxim%20Integrated/view-part/48834/?ref=snap; Value: *
S8050#1 S8050#2 = S8050 Transistor: NPN Transistor, 2W output Ic = 1.5A; MP: 2N2222A; MF: Solid State Inc.; Price: None; SnapEDA_Link: https://www.snapeda.com/parts/2N2222A/Solid+State+Inc/view-part/?ref=snap; Availability: In Stock; Package: TO-18-3 Solid State Inc.; Check_prices: https://www.snapeda.com/parts/2N2222A/Solid+State+Inc/view-part/?ref=eda; Value: *; Purchase-URL: https://pricing.snapeda.com/search/part/2N2222A/?ref=eda
Voltage_Regulator_3.3V Voltage_Regulator_5V = Voltage Regulator: TO-263-5/XL4015E1 5A 75W Adjustable DC/DC STEP DOWN CONVERTER Regulator IC SMD
Y1 = Crystal 16MHZ
ESP-WROOM32 = ESP32-WROOM-32: Package: None; MP: ESP32-WROOM-32; Value: *; Price: None; Availability: Unavailable